# EAGLE schematic openLRS-APM (EAGLE 7.1.0)
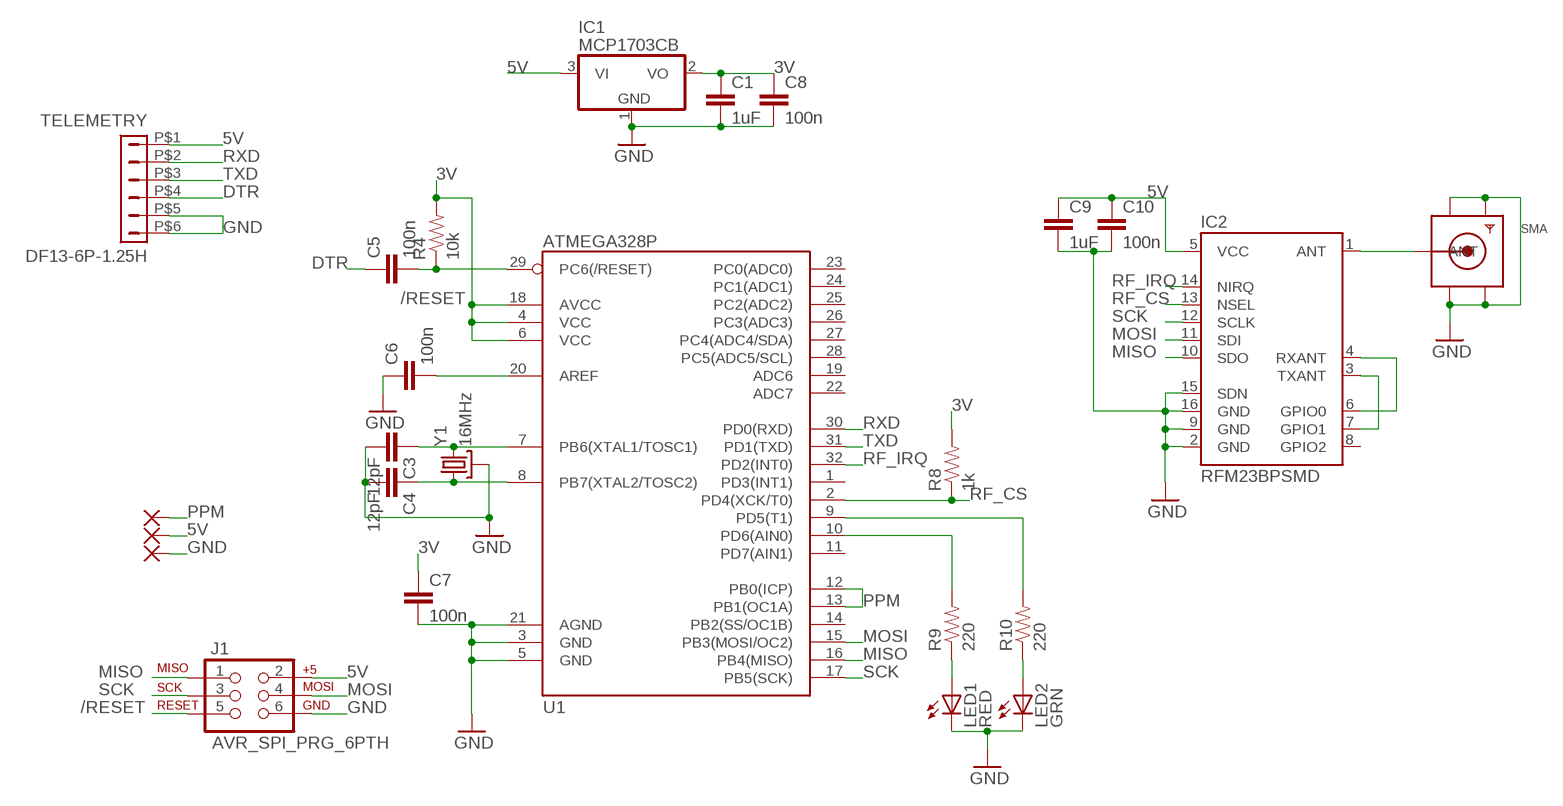
[diagram p0: schematic, sheet 1]

## Parts
C1  1uF  CAP0805  [0805]
C3  12pF  CAP0805  [0805]
C4  12pF  CAP0805  [0805]
C5  100n  CAP0805  [0805]
C6  100n  CAP0805  [0805]
C7  100n  CAP0805  [0805]
C8  100n  CAP0805  [0805]
C9  1uF  CAP0805  [0805]
C10  100n  CAP0805  [0805]
GND  WIREPADSMD1,27-254  [SMD1,27-2,54]
IC1  MCP1703CB  [SOT23]
IC2  RFM23BPSMD  [RFM23BP-S2]
J1  AVR_SPI_PRG_6PTH  [2X3]
LED1  RED  LEDSML0805  [SML0805]
LED2  GRN  LEDSML0805  [SML0805]
PPM  WIREPADSMD1,27-254  [SMD1,27-2,54]
R4  10k  RESISTOR0805-RES  [0805]
R8  1k  RESISTOR0805-RES  [0805]
R9  220  RESISTOR0805-RES  [0805]
R10  220  RESISTOR0805-RES  [0805]
SMA  SMACONNECTOR_EDGE  [SMA_EDGELAUNCH]
TELEMETRY  DF13-6P-1.25H  [DF13A-6P-1.25H]
U1  ATMEGA328P  ATMEGA328_SMT  [TQFP32-08]
VCC  WIREPADSMD1,27-254  [SMD1,27-2,54]
Y1  16MHz  CRYSTAL3.2X2.5  [CRYSTAL-SMD-5X3]

## Nets
3V: C1.1 C7.1 C8.1 IC1.2(VO) R4.2 R8.2 U1.4(VCC) U1.6(VCC) U1.18(AVCC)
5V: C9.1 C10.1 IC1.3(VI) IC2.5(VCC) J1.2 TELEMETRY.P$1 VCC.1(P)
/RESET: C5.2 J1.5 R4.1 U1.29(PC6(/RESET))
DTR: C5.1 TELEMETRY.P$4
GND: C1.2 C3.2 C4.2 C6.1 C7.2 C8.2 C9.2 C10.2 GND.1(P) IC1.1(GND) IC2.2(GND) IC2.9(GND) IC2.15(SDN) IC2.16(GND) J1.6 LED1.C LED2.C SMA.GND@1(GND4) SMA.GND@2(GND3) SMA.GND@3(GND2) SMA.GND@4(GND1) TELEMETRY.P$5 TELEMETRY.P$6 U1.3(GND) U1.5(GND) U1.21(AGND) Y1.2(GND) Y1.4(GND)
MISO: IC2.10(SDO) J1.1 U1.16(PB4(MISO))
MOSI: IC2.11(SDI) J1.4 U1.15(PB3(MOSI/OC2))
N$1: IC2.3(TXANT) IC2.7(GPIO1)
N$2: IC2.4(RXANT) IC2.6(GPIO0)
N$7: R9.2 U1.10(PD6(AIN0))
N$8: R10.2 U1.9(PD5(T1))
N$9: LED2.A R10.1
N$10: LED1.A R9.1
N$11: C3.1 U1.7(PB6(XTAL1/TOSC1)) Y1.3
N$12: C4.1 U1.8(PB7(XTAL2/TOSC2)) Y1.1
N$13: IC2.1(ANT) SMA.P(ANT)
N$14: C6.2 U1.20(AREF)
PPM: PPM.1(P) U1.12(PB0(ICP)) U1.13(PB1(OC1A))
RF_CS: IC2.13(NSEL) R8.1 U1.2(PD4(XCK/T0))
RF_IRQ: IC2.14(NIRQ) U1.32(PD2(INT0))
RXD: TELEMETRY.P$2 U1.30(PD0(RXD))
SCK: IC2.12(SCLK) J1.3 U1.17(PB5(SCK))
TXD: TELEMETRY.P$3 U1.31(PD1(TXD))
Unconnected: IC2.8(GPIO2) U1.1(PD3(INT1)) U1.11(PD7(AIN1)) U1.14(PB2(SS/OC1B)) U1.19(ADC6) U1.22(ADC7) U1.23(PC0(ADC0)) U1.24(PC1(ADC1)) U1.25(PC2(ADC2)) U1.26(PC3(ADC3)) U1.27(PC4(ADC4/SDA)) U1.28(PC5(ADC5/SCL))

## Library data of the parts
C1 C3-C10 = SparkFun-Capacitors:CAP: Capacitor Standard 0603 ceramic capacitor, and 0.1" leaded capacitor.
GND PPM VCC = wirepad:WIREPAD: Wire PAD connect wire on PCB
IC1 = linear:MCP1703: 250 mA, 16V, Low Quiescent Current LDO Regulator Source: http://ww1.microchip.com/downloads/en/DeviceDoc/22049b.pdf
IC2 = RFM23:RFM23BP: The RFM23BP is a medium power, low cost radio that is capable of operating in the 434MHz and 900MHz open bands. It's frequency is software defined and there are some very good libraries written for it.
J1 = SparkFun-Connectors:AVR_SPI_PRG_6: AVR ISP 6 Pin This is the reduced ISP connector for AVR programming. Common on Arduino. This footprint will take up less PCB space and can be used with a 10-pin to 6-pin adapter such as SKU: BOB-08508
LED1 LED2 = led:LED: LED OSRAM: - CHIPLED LG R971, LG N971, LY N971, LG Q971, LY Q971, LO R971, LY R971 LH N974, LH R974 LS Q976, LO Q976, LY Q976 LO Q996 - Hyper CHIPLED LW Q18S LB Q993, LB Q99A, LB R99A - SideLED LS A670, LO A670, LY A670, LG A670, LP A670 LB A673, LV A673, LT A673, LW A673 LH A674 LY A675 LS A676, LA A676, LO A676, LY A676, LW A676 LS A679, LY A679, LG A679 - Hyper Micro SIDELED® LS Y876, LA Y876, LO Y876, LY Y876 LT Y87S - SmartLED LW L88C, LW L88S LB L89C, LB L89S, LG L890 LS L89K, LO L89K, LY L89K LS L896, LA L896, LO L896, LY L896 - TOPLED LS T670, LO T670, LY T670, LG T670, LP T670 LSG T670, LSP T670, LSY T670, LOP T670, LYG T670 LG T671, LOG T671, LSG T671 LB T673, LV T673, LT T673, LW T673 LH T674 LS T676, LA T676, LO T676, LY T676, LB T676, LH T676, LSB T676, LW T676 LB T67C, LV T67C, LT T67C, LS T67K, LO T67K, LY T67K, LW E67C LS E67B, LA E67B, LO E67B, LY E67B, LB E67C, LV E67C, LT E67C LW T67C LS T679, LY T679, LG T679 LS T770, LO T770, LY T770, LG T770, LP T770 LB T773, LV T773, LT T773, LW T773 LH T774 LS E675, LA E675, LY E675, LS T675 LS T776, LA T776, LO T776, LY T776, LB T776 LHGB T686 LT T68C, LB T68C - Hyper Mini TOPLED® LB M676 - Mini TOPLED Santana® LG M470 LS M47K, LO M47K, LY M47K Source: http://www.osram.convergy.de LUXEON: - LUMILED® LXK2-PW12-R00, LXK2-PW12-S00, LXK2-PW14-U00, LXK2-PW14-V00 LXK2-PM12-R00, LXK2-PM12-S00, LXK2-PM14-U00 LXK2-PE12-Q00, LXK2-PE12-R00, LXK2-PE12-S00, LXK2-PE14-T00, LXK2-PE14-U00 LXK2-PB12-K00, LXK2-PB12-L00, LXK2-PB12-M00, LXK2-PB14-N00, LXK2-PB14-P00, LXK2-PB14-Q00 LXK2-PR12-L00, LXK2-PR12-M00, LXK2-PR14-Q00, LXK2-PR14-R00 LXK2-PD12-Q00, LXK2-PD12-R00, LXK2-PD12-S00 LXK2-PH12-R00, LXK2-PH12-S00 LXK2-PL12-P00, LXK2-PL12-Q00, LXK2-PL12-R00 Source: www.luxeon.com KINGBRIGHT: KA-3528ASYC Source: www.kingbright.com
R4 R8-R10 = SparkFun-Resistors:RESISTOR: Resistor Basic schematic elements and footprints for 0603, 1206, and PTH resistors.
SMA = adafruit:SMACONNECTOR: SMA Connector 90° DIP SMA Connector, 50 Ohm (4UConnector: 07259)
TELEMETRY = con-hirose-df13:DF13-6P-1.25: DF13-6P 1.25mm Pitch Miniature Crimping Connector.
U1 = SparkFun-DigitalIC:ATMEGA328_SMT: 32-Pin Atmega328 part Commonly used on Arduino compatible boards Available in QFP and QFN packages TQFP is IC-09069 QFN is non-stock; PROD_ID: IC-09069
Y1 = crystal_3225:CRYSTAL: Various standard crystals. Proven footprints. Spark Fun Electronics SKU : COM-00534

## Net classes
0 default: clearance 0.205 mm